# EAGLE design funkuhr (EAGLE 6.5.0)
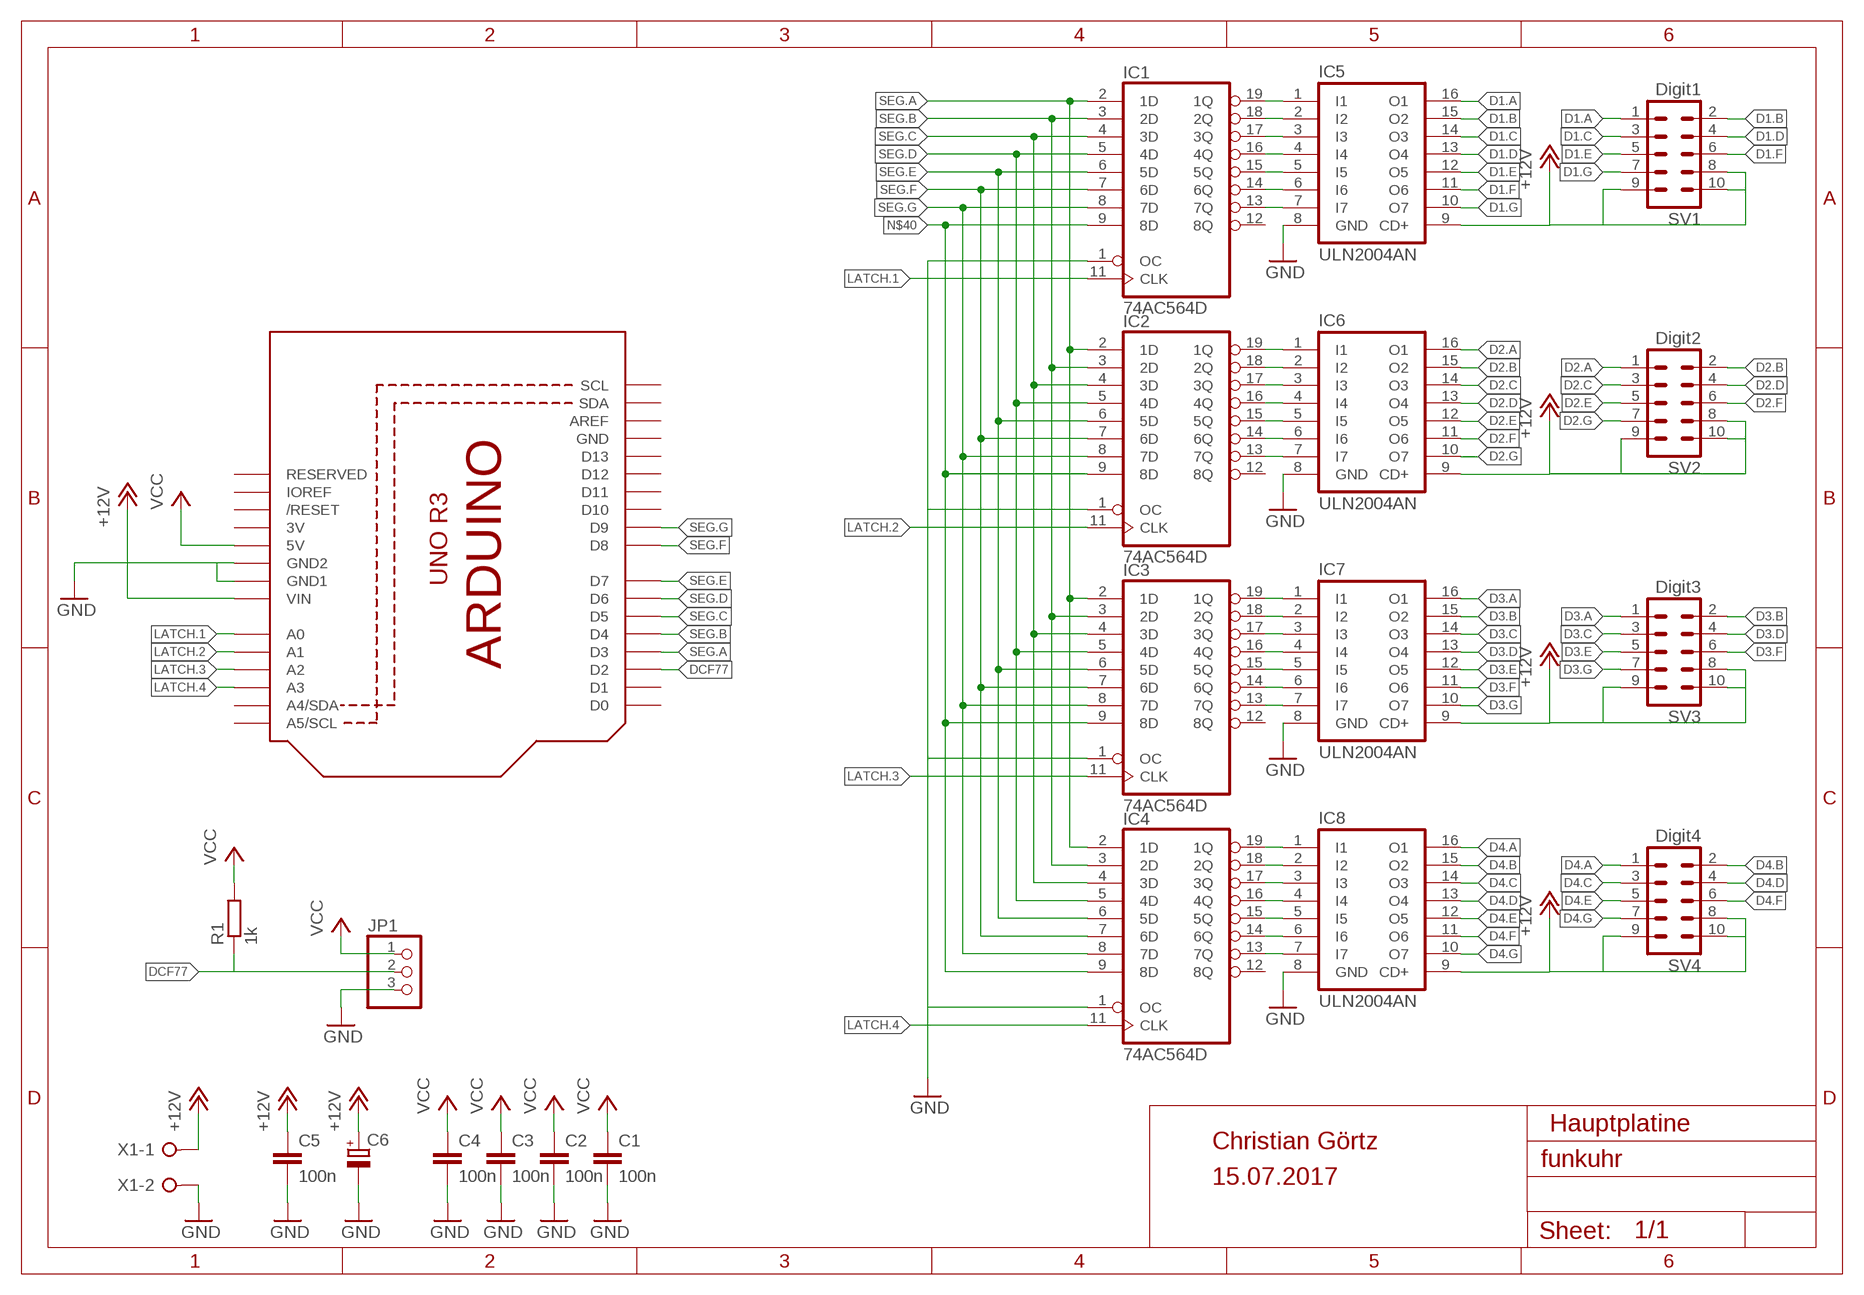
[diagram p0: schematic, sheet 1]

## Parts
C1  100n  C-EUC0805  [C0805]
C2  100n  C-EUC0805  [C0805]
C3  100n  C-EUC0805  [C0805]
C4  100n  C-EUC0805  [C0805]
C5  100n  C-EU050-024X044  [C050-024X044]
C6  CPOL-EUE2.5-6  [E2,5-6]
IC1  74AC564D  [SO20W]
IC2  74AC564D  [SO20W]
IC3  74AC564D  [SO20W]
IC4  74AC564D  [SO20W]
IC5  ULN2004AN  [DIL16]
IC6  ULN2004AN  [DIL16]
IC7  ULN2004AN  [DIL16]
IC8  ULN2004AN  [DIL16]
JP1  PINHD-1X3  [1X03]
R1  1k  R-EU_0207/10  [0207/10]
SV1  Digit1  ML10  [ML10]
SV2  Digit2  ML10  [ML10]
SV3  Digit3  ML10  [ML10]
SV4  Digit4  ML10  [ML10]
U1  ARDUINOR3-DIMENSION  [ARDUINOR3]
X1  W237-02P  [W237-132]

## Nets
+12V: C5.1 C6.+ IC5.9(CD+) IC6.9(CD+) IC7.9(CD+) IC8.9(CD+) SV1.8 SV1.9 SV1.10 SV2.8 SV2.9 SV2.10 SV3.8 SV3.9 SV3.10 SV4.8 SV4.9 SV4.10 U1.VIN X1.1
D1.A: IC5.16(O1) SV1.1
D1.B: IC5.15(O2) SV1.2
D1.C: IC5.14(O3) SV1.3
D1.D: IC5.13(O4) SV1.4
D1.E: IC5.12(O5) SV1.5
D1.F: IC5.11(O6) SV1.6
D1.G: IC5.10(O7) SV1.7
D2.A: IC6.16(O1) SV2.1
D2.B: IC6.15(O2) SV2.2
D2.C: IC6.14(O3) SV2.3
D2.D: IC6.13(O4) SV2.4
D2.E: IC6.12(O5) SV2.5
D2.F: IC6.11(O6) SV2.6
D2.G: IC6.10(O7) SV2.7
D3.A: IC7.16(O1) SV3.1
D3.B: IC7.15(O2) SV3.2
D3.C: IC7.14(O3) SV3.3
D3.D: IC7.13(O4) SV3.4
D3.E: IC7.12(O5) SV3.5
D3.F: IC7.11(O6) SV3.6
D3.G: IC7.10(O7) SV3.7
D4.A: IC8.16(O1) SV4.1
D4.B: IC8.15(O2) SV4.2
D4.C: IC8.14(O3) SV4.3
D4.D: IC8.13(O4) SV4.4
D4.E: IC8.12(O5) SV4.5
D4.F: IC8.11(O6) SV4.6
D4.G: IC8.10(O7) SV4.7
DCF77: JP1.2 R1.1 U1.D2
GND: C1.2 C2.2 C3.2 C4.2 C5.2 C6.- IC1.1(OC) IC2.1(OC) IC3.1(OC) IC4.1(OC) IC5.8(GND) IC6.8(GND) IC7.8(GND) IC8.8(GND) JP1.3 U1.GND1 U1.GND2 X1.2
LATCH.1: IC1.11(CLK) U1.A0
LATCH.2: IC2.11(CLK) U1.A1
LATCH.3: IC3.11(CLK) U1.A2
LATCH.4: IC4.11(CLK) U1.A3
N$1: IC1.19(1Q) IC5.1(I1)
N$2: IC1.18(2Q) IC5.2(I2)
N$3: IC1.17(3Q) IC5.3(I3)
N$4: IC1.16(4Q) IC5.4(I4)
N$5: IC1.15(5Q) IC5.5(I5)
N$6: IC1.14(6Q) IC5.6(I6)
N$7: IC1.13(7Q) IC5.7(I7)
N$9: IC2.19(1Q) IC6.1(I1)
N$10: IC2.18(2Q) IC6.2(I2)
N$11: IC2.17(3Q) IC6.3(I3)
N$12: IC2.16(4Q) IC6.4(I4)
N$13: IC2.15(5Q) IC6.5(I5)
N$14: IC2.14(6Q) IC6.6(I6)
N$15: IC2.13(7Q) IC6.7(I7)
N$17: IC3.19(1Q) IC7.1(I1)
N$18: IC3.18(2Q) IC7.2(I2)
N$19: IC3.17(3Q) IC7.3(I3)
N$20: IC3.16(4Q) IC7.4(I4)
N$21: IC3.15(5Q) IC7.5(I5)
N$22: IC3.14(6Q) IC7.6(I6)
N$23: IC3.13(7Q) IC7.7(I7)
N$25: IC4.19(1Q) IC8.1(I1)
N$26: IC4.18(2Q) IC8.2(I2)
N$27: IC4.17(3Q) IC8.3(I3)
N$28: IC4.16(4Q) IC8.4(I4)
N$29: IC4.15(5Q) IC8.5(I5)
N$30: IC4.14(6Q) IC8.6(I6)
N$31: IC4.13(7Q) IC8.7(I7)
N$40: IC1.9(8D) IC2.9(8D) IC3.9(8D) IC4.9(8D)
SEG.A: IC1.2(1D) IC2.2(1D) IC3.2(1D) IC4.2(1D) U1.D3
SEG.B: IC1.3(2D) IC2.3(2D) IC3.3(2D) IC4.3(2D) U1.D4
SEG.C: IC1.4(3D) IC2.4(3D) IC3.4(3D) IC4.4(3D) U1.D5
SEG.D: IC1.5(4D) IC2.5(4D) IC3.5(4D) IC4.5(4D) U1.D6
SEG.E: IC1.6(5D) IC2.6(5D) IC3.6(5D) IC4.6(5D) U1.D7
SEG.F: IC1.7(6D) IC2.7(6D) IC3.7(6D) IC4.7(6D) U1.D8
SEG.G: IC1.8(7D) IC2.8(7D) IC3.8(7D) IC4.8(7D) U1.D9
VCC: C1.1 C2.1 C3.1 C4.1 JP1.1 R1.2 U1.5V
Unconnected: IC1.12(8Q) IC2.12(8Q) IC3.12(8Q) IC4.12(8Q) U1.A4(A4/SDA) U1.A5(A5/SCL) U1.AREF U1.D0 U1.D1 U1.D10 U1.D11 U1.D12 U1.D13 U1.IOREF U1.RESERVED U1.RESET(/RESET) U1.SCL U1.SDA

## Notes on the sheet
- Hauptplatine
- Christian Görtz
- 15.07.2017

## Power pins joined to a net without a drawn wire
3V: U1.3V
GND: IC1.10(GND) IC2.10(GND) IC3.10(GND) IC4.10(GND) U1.GND
VCC: IC1.20(VCC) IC2.20(VCC) IC3.20(VCC) IC4.20(VCC)

## Library data of the parts
C1-C5 = resistor:C-EU: CAPACITOR, European symbol
C6 = resistor:CPOL-EU: POLARIZED CAPACITOR, European symbol
IC1-IC4 = 74xx-eu:74*564: Inverting 8-bit D type FLIP FLOP
IC5-IC8 = uln-udn:ULN2004A: DRIVER ARRAY
JP1 = pinhead:PINHD-1X3: PIN HEADER
R1 = resistor:R-EU_: RESISTOR, European symbol
SV1-SV4 = con-harting-ml:ML10: HARTING; OC_FARNELL: unknown; OC_NEWARK: unknown
U1 = adafruit:ARDUINOR3: This is a new object for the new Arduino R3 - with extra pins that you may want to use (such as IOref, and duplicated A4/A5
X1 = con-wago-508:W237-02P: WAGO SREW CLAMP; OC_FARNELL: unknown; OC_NEWARK: unknown

## Board
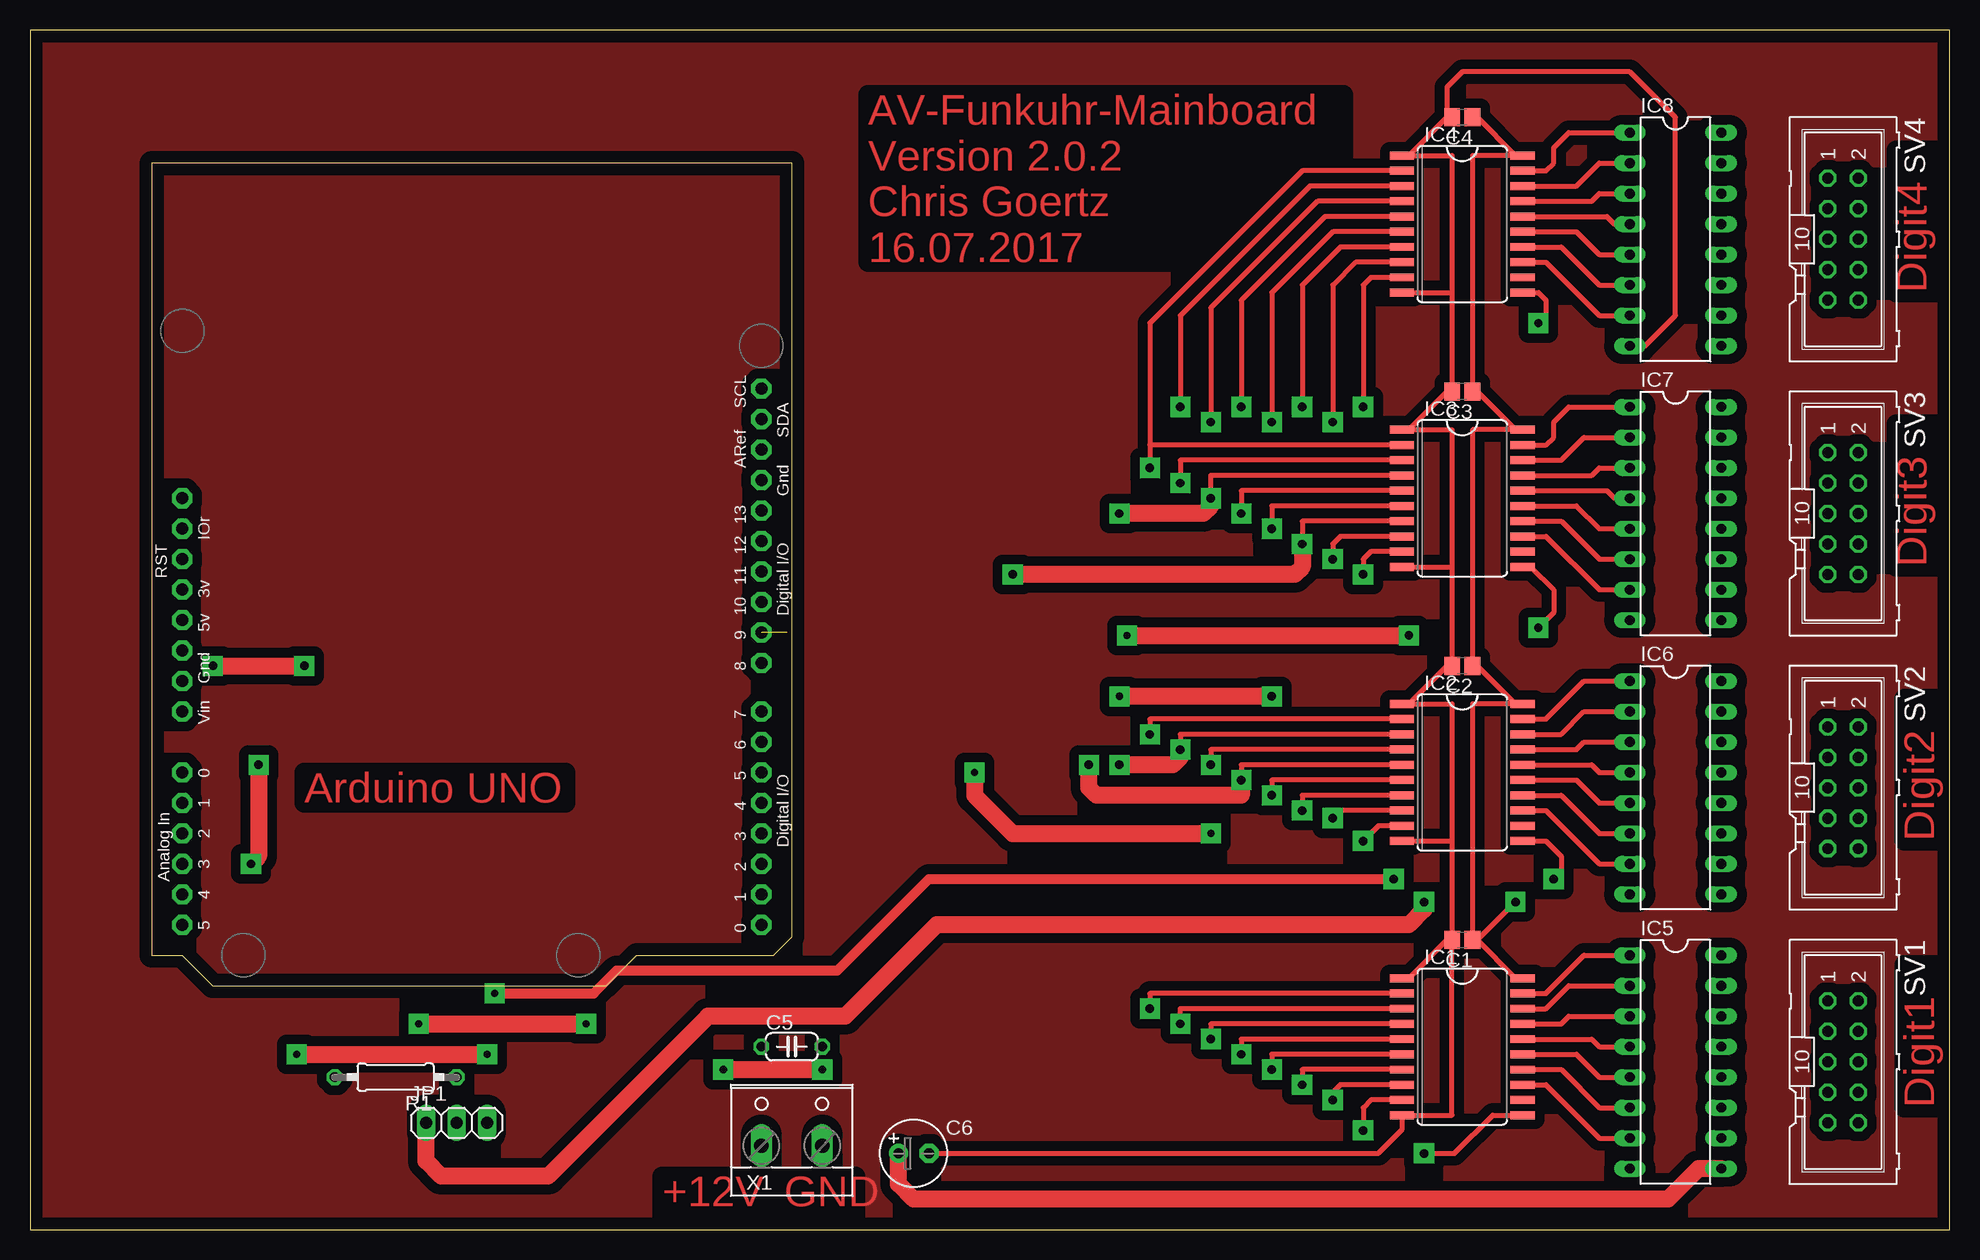
[diagram p1: board, top side]
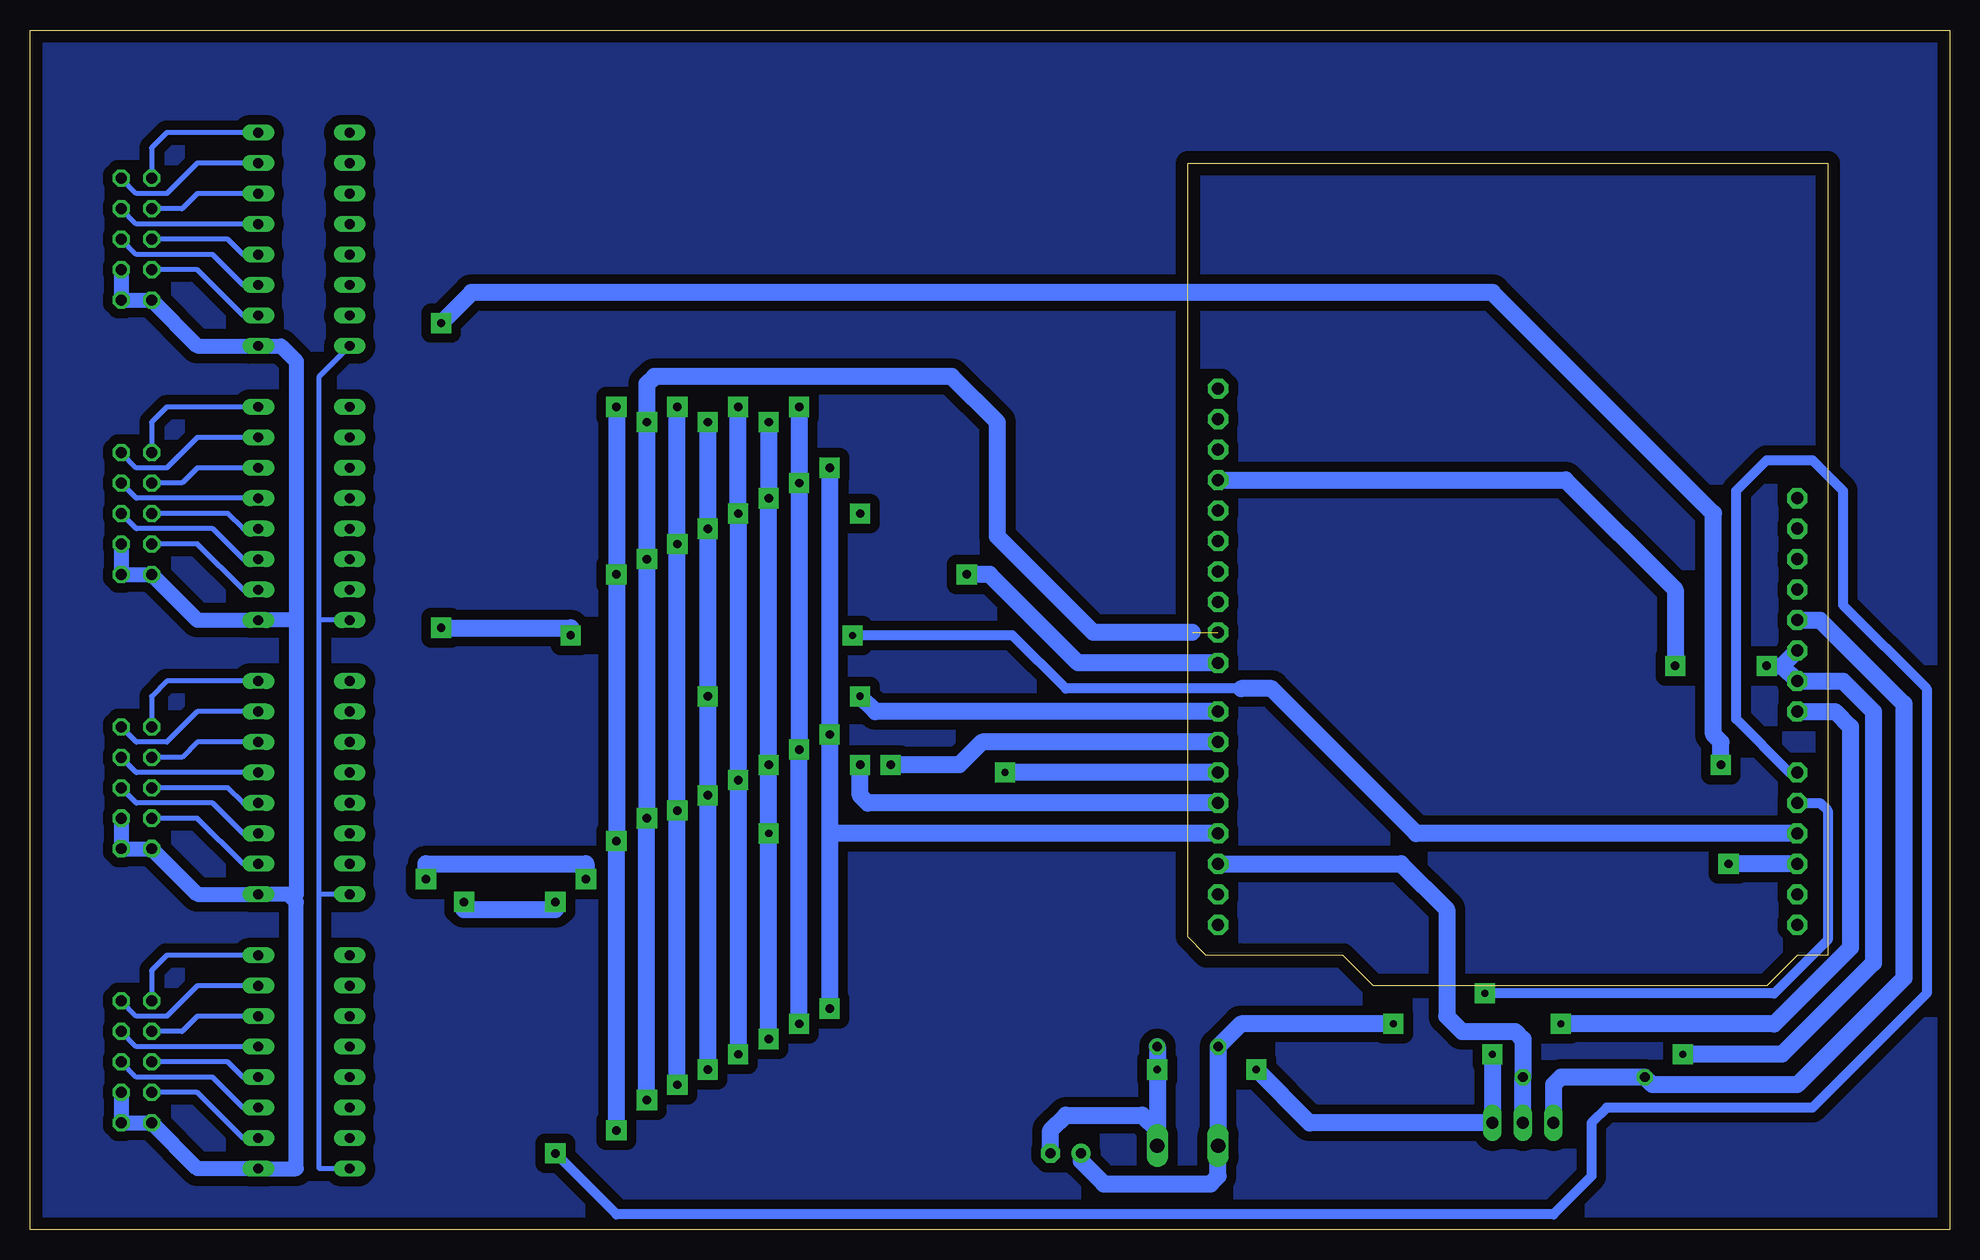
[diagram p2: board, bottom side, seen from below]

Size 160 x 100 mm. Coordinates in mm from the lower left corner, seen from the top.
Outline: 0,0 160,0 160,100 0,100 0,0
Copper layers (1*16): Top 0.035mm / dielectric 1.5mm / Bottom 0.035mm
Design rules "default": minimum track width 10mil, minimum drill 24mil, track to track 8mil, track to pad 8mil, pad to pad 8mil, via to via 8mil, smd to smd 8mil, copper to edge 40mil, drill to drill 8mil, minimum pad ring 10mil, minimum via ring 8mil, stop-mask expansion 4mil, vias tented up to drill 0mil, thermal gap 10mil

### Footprints (pad centres in the part's own frame; a part is rotated, then mirrored left to right if it is on the bottom)
C0805 = smd 1.3 x 1.5: 1 -0.85,0; 2 0.85,0
C050-024X044 = drill 0.813 octagon: 1 -2.54,0; 2 2.54,0
E2,5-6 = drill 0.813 pad 1.6: + -1.27,0 | drill 0.813 pad 1.6 octagon: - 1.27,0
SO20W = smd 0.66 x 2.032: 1 -5.715,-5.029; 2 -4.445,-5.029; 3 -3.175,-5.029; 4 -1.905,-5.029; 5 -0.635,-5.029; 6 0.635,-5.029; 7 1.905,-5.029; 8 3.175,-5.029; 9 4.445,-5.029; 10 5.715,-5.029; 11 5.715,5.029; 12 4.445,5.029; 13 3.175,5.029; 14 1.905,5.029; 15 0.635,5.029; 16 -0.635,5.029; 17 -1.905,5.029; 18 -3.175,5.029; 19 -4.445,5.029; 20 -5.715,5.029
DIL16 = drill 0.813 long: 1 -8.89,-3.81; 2 -6.35,-3.81; 3 -3.81,-3.81; 4 -1.27,-3.81; 5 1.27,-3.81; 6 3.81,-3.81; 7 6.35,-3.81; 8 8.89,-3.81; 9 8.89,3.81; 10 6.35,3.81; 11 3.81,3.81; 12 1.27,3.81; 13 -1.27,3.81; 14 -3.81,3.81; 15 -6.35,3.81; 16 -8.89,3.81
1X03 = drill 1.016 long: 1 -2.54,0; 2 0,0; 3 2.54,0
0207/10 = drill 0.813 octagon: 1 -5.08,0; 2 5.08,0
ML10 = drill 0.914 octagon: 1 -5.08,-1.27; 2 -5.08,1.27; 3 -2.54,-1.27; 4 -2.54,1.27; 5 0,-1.27; 6 0,1.27; 7 2.54,-1.27; 8 2.54,1.27; 9 5.08,-1.27; 10 5.08,1.27
ARDUINOR3 = drill 1 pad 1.676 octagon: 3V 35.56,2.54; 5V 38.1,2.54; A0 50.8,2.54; A1 53.34,2.54; A2 55.88,2.54; A3 58.42,2.54; A4 60.96,2.54; A5 63.5,2.54; AREF 23.876,50.8; D0 63.5,50.8; D1 60.96,50.8; D2 58.42,50.8; D3 55.88,50.8; D4 53.34,50.8; D5 50.8,50.8; D6 48.26,50.8; D7 45.72,50.8; D8 41.656,50.8; D9 39.116,50.8; D10 36.576,50.8; D11 34.036,50.8; D12 31.496,50.8; D13 28.956,50.8; GND 26.416,50.8; GND1 43.18,2.54; GND2 40.64,2.54; IOREF 30.48,2.54; RESERVED 27.94,2.54; RESET 33.02,2.54; SCL 18.796,50.8; SDA 21.336,50.8; VIN 45.72,2.54
W237-132 = drill 1.194 long: 1 -2.54,-0.635; 2 2.54,-0.635

### Placement (x,y rotation side)
C1  119.38,24.13 180 top
C2  119.38,46.99 180 top
C3  119.38,69.85 180 top
C4  119.38,92.71 180 top
C5  63.5,15.24 0 top
C6  73.66,6.35 0 top
IC1  119.38,15.24 270 top
IC2  119.38,38.1 270 top
IC3  119.38,60.96 270 top
IC4  119.38,83.82 270 top
IC5  137.16,13.97 270 top
IC6  137.16,36.83 270 top
IC7  137.16,59.69 270 top
IC8  137.16,82.55 270 top
JP1  35.56,8.89 0 top
R1  30.48,12.7 180 top
SV1  151.13,13.97 270 top
SV2  151.13,36.83 270 top
SV3  151.13,59.69 270 top
SV4  151.13,82.55 270 top
U1  10.16,88.9 270 top
X1  63.5,7.62 0 top

### Tracks (layer width: path | path; a pad name or v marks a point on that pad's centre or on a via)
+12V  (via drill 0.6 pad 1.68)
  Top 1.422: IC5.9 139.06,5.08 136.53,2.54 73.66,2.54 72.39,3.81 C6.+ | v32.38,17.14 v46.35,17.14
  Bottom 0.406: IC8.9 142.24,73.66 | IC5.9 138.43,5.08
  Bottom 1.27: 137.79,50.8 137.79,72.39 139.06,73.66 IC8.9 146.05,73.66 SV4.9 SV4.10 SV4.8 | 137.79,50.8 IC7.9 146.05,50.8 SV3.9 SV3.10 SV3.8 | 137.79,50.8 137.79,27.94 138.43,27.94 | 138.43,27.94 IC6.9 146.05,27.94 SV2.9 SV2.10 SV2.8 | 138.43,27.94 137.79,27.3 137.79,5.08 IC5.9 146.05,5.08 SV1.9 SV1.10 SV1.8
  Bottom 1.422: C6.+ 72.39,5.71 70.48,3.81 61.59,3.81 60.96,4.45 X1.1 C5.1 59.05,17.14 v46.35,17.14 | U1.VIN 9.53,43.18 8.26,41.91 8.26,23.5 14.61,17.14 v32.38,17.14
D1.A
  Bottom 0.406: IC5.16 148.59,22.86 149.86,21.59 SV1.1
D1.B
  Bottom 0.406: IC5.15 146.05,20.32 148.59,17.78 151.13,17.78 SV1.2
D1.C
  Bottom 0.406: IC5.14 146.05,17.78 147.32,16.51 SV1.3
D1.D
  Bottom 0.406: IC5.13 151.13,15.24 SV1.4
D1.E
  Bottom 0.406: IC5.12 142.24,12.7 143.51,13.97 SV1.5
D1.F
  Bottom 0.406: IC5.11 142.24,10.16 144.78,12.7 151.13,12.7 SV1.6
D1.G
  Bottom 0.406: IC5.10 142.24,7.62 146.05,11.43 SV1.7
D2.A
  Bottom 0.406: IC6.16 148.59,45.72 149.86,44.45 SV2.1
D2.B
  Bottom 0.406: IC6.15 146.05,43.18 148.59,40.64 151.13,40.64 SV2.2
D2.C
  Bottom 0.406: IC6.14 146.05,40.64 147.32,39.37 SV2.3
D2.D
  Bottom 0.406: IC6.13 151.13,38.1 SV2.4
D2.E
  Bottom 0.406: IC6.12 142.24,35.56 143.51,36.83 SV2.5
D2.F
  Bottom 0.406: IC6.11 142.24,33.02 144.78,35.56 151.13,35.56 SV2.6
D2.G
  Bottom 0.406: IC6.10 142.24,30.48 146.05,34.29 SV2.7
D3.A
  Bottom 0.406: IC7.16 148.59,68.58 149.86,67.31 SV3.1
D3.B
  Bottom 0.406: IC7.15 146.05,66.04 148.59,63.5 151.13,63.5 SV3.2
D3.C
  Bottom 0.406: IC7.14 146.05,63.5 147.32,62.23 SV3.3
D3.D
  Bottom 0.406: IC7.13 151.13,60.96 SV3.4
D3.E
  Bottom 0.406: IC7.12 142.24,58.42 143.51,59.69 SV3.5
D3.F
  Bottom 0.406: IC7.11 142.24,55.88 144.78,58.42 151.13,58.42 SV3.6
D3.G
  Bottom 0.406: IC7.10 142.24,53.34 146.05,57.15 SV3.7
D4.A
  Bottom 0.406: IC8.16 148.59,91.44 149.86,90.17 SV4.1
D4.B
  Bottom 0.406: IC8.15 146.05,88.9 148.59,86.36 151.13,86.36 SV4.2
D4.C
  Bottom 0.406: IC8.14 146.05,86.36 147.32,85.09 SV4.3
D4.D
  Bottom 0.406: IC8.13 151.13,83.82 SV4.4
D4.E
  Bottom 0.406: IC8.12 142.24,81.28 143.51,82.55 SV4.5
D4.F
  Bottom 0.406: IC8.11 142.24,78.74 144.78,81.28 151.13,81.28 SV4.6
D4.G
  Bottom 0.406: IC8.10 142.24,76.2 146.05,80.01 SV4.7
DCF77
  Bottom 1.422: JP1.2 R1.1 35.56,15.88 36.2,16.51 40.64,16.51 41.91,17.78 41.91,26.67 45.72,30.48 U1.D2
GND  (via drill 0.6 pad 1.68, 0.7 pad 1.68)
  Top 0.406: IC1.1 114.94,20.95 118.11,24.13 C1.2 | 118.53,78.11 118.53,89.53 IC4.1 114.94,89.53 118.11,92.71 C4.2 118.11,93.13 118.11,95.25 119.38,96.52 133.35,96.52 137.16,92.71 137.16,76.2 134.62,73.66 IC8.8 | 118.53,78.11 C3.2 118.11,69.85 114.94,66.67 IC3.1 118.53,66.67 118.53,55.24 | IC4.10 118.53,78.11 | 118.53,55.24 C2.2 118.11,46.99 114.94,43.81 IC2.1 118.53,43.81 118.53,32.38 | IC3.10 118.53,55.24 | IC2.10 118.53,32.38 | 118.53,32.38 C1.2 | C1.2 118.53,9.53 IC1.10 114.35,8.31 112.39,6.35 C6.-
  Top 1.422: v22.23,14.61 v38.1,14.61 | v57.78,13.34 v66.04,13.34 | v15.24,46.99 v22.86,46.99
  Bottom 0.406: 135.89,27.94 135.89,5.08 IC5.8 | 135.89,27.94 135.89,50.8 | 135.89,50.8 135.89,71.12 IC8.8 | IC7.8 135.89,50.8 | IC6.8 135.89,27.94
  Bottom 1.422: C6.- 74.93,8.26 73.66,9.53 67.31,9.53 66.04,8.26 X1.2 v66.04,13.34 C5.2 | v15.24,46.99 13.97,46.99 | 13.97,46.99 U1.GND1 8.89,45.72 6.35,43.18 6.35,22.23 13.97,14.61 v22.23,14.61 | U1.GND2 13.97,46.99 | v38.1,14.61 JP1.3 53.34,8.89 v57.78,13.34 | U1.GND 32,62.48 22.86,53.34 v22.86,46.99
LATCH.1  (via drill 0.7 pad 1.68)
  Top 0.406: v116.2,6.35 118.75,6.35 121.92,9.53 IC1.11
  Bottom 0.406: 34.29,1.27 111.12,1.27
  Bottom 0.813: U1.A0 13.34,38.1 17.78,42.55 17.78,61.59 15.24,64.14 11.43,64.14 8.89,61.59 8.89,52.07 1.91,45.09 1.91,19.68 11.43,10.16 28.57,10.16 29.84,8.89 29.84,4.45 33.02,1.27 111.12,1.27 v116.2,6.35
LATCH.2  (via drill 0.6 pad 1.68, 0.7 pad 1.68)
  Top 0.406: IC2.11 126.36,32.38 127.64,31.11 127.64,29.84 v127,29.21
  Top 0.813: v38.73,19.68 46.99,19.68 48.9,21.59 67.31,21.59 74.93,29.21 v113.67,29.21
  Bottom 0.813: U1.A1 10.79,35.56 10.16,34.92 10.16,24.13 14.61,19.68 v38.73,19.68
  Bottom 1.422: v127,29.21 127,30.48 113.67,30.48 v113.67,29.21
LATCH.3  (via drill 0.6 pad 1.68, 0.7 pad 1.68)
  Top 0.406: IC3.11 125.09,55.24 127,53.34 127,51.44 v125.73,50.16
  Top 1.422: v91.44,49.53 v114.94,49.53
  Bottom 0.406: 115.57,50.16 v114.94,49.53
  Bottom 0.813: 59.05,45.09 73.66,45.09 78.11,49.53 v91.44,49.53
  Bottom 1.422: v125.73,50.16 114.94,50.16 v114.94,49.53 | U1.A2 44.45,33.02 56.52,45.09 59.05,45.09
LATCH.4  (via drill 0.7 pad 1.68)
  Top 0.406: IC4.11 125.73,78.11 126.36,77.47 126.36,76.2 v125.73,75.56
  Top 1.422: v19.05,38.73 19.05,31.11 v18.41,30.48
  Bottom 1.422: U1.A3 v18.41,30.48 | v19.05,38.73 19.05,40.64 19.68,41.27 19.68,59.69 38.1,78.11 123.19,78.11 v125.73,75.56
N$1
  Top 0.406: IC1.19 126.36,19.68 129.54,22.86 IC5.1
N$2
  Top 0.406: IC1.18 126.36,18.41 128.27,20.32 IC5.2
N$3
  Top 0.406: IC1.17 127.64,17.14 128.27,17.78 IC5.3
N$4
  Top 0.406: IC1.16 130.18,15.88 130.81,15.24 IC5.4
N$5
  Top 0.406: IC1.15 128.91,14.61 130.81,12.7 IC5.5
N$6
  Top 0.406: IC1.14 127.64,13.34 130.81,10.16 IC5.6
N$7
  Top 0.406: IC1.13 126.36,12.06 130.81,7.62 IC5.7
N$8
  pour Top (isolate 0.813): 0,99.69 160.02,99.69 160.02,0 0,0
N$9
  Top 0.406: IC2.19 126.36,42.55 129.54,45.72 IC6.1
N$10
  Top 0.406: IC2.18 127.64,41.27 129.54,43.18 IC6.2
N$11
  Top 0.406: IC2.17 128.91,40.01 129.54,40.64 IC6.3
N$12
  Top 0.406: IC2.16 130.18,38.73 130.81,38.1 IC6.4
N$13
  Top 0.406: IC2.15 128.91,37.47 130.81,35.56 IC6.5
N$14
  Top 0.406: IC2.14 127.64,36.2 130.81,33.02 IC6.6
N$15
  Top 0.406: IC2.13 126.36,34.92 130.81,30.48 IC6.7
N$16
  pour Bottom (isolate 0.813): 0,99.69 160.02,99.69 160.02,0 0,0
N$17
  Top 0.406: IC3.19 126.36,65.41 127,66.04 127,67.31 128.27,68.58 IC7.1
N$18
  Top 0.406: IC3.18 127.64,64.14 129.54,66.04 IC7.2
N$19
  Top 0.406: IC3.17 130.18,62.87 130.81,63.5 IC7.3
N$20
  Top 0.406: IC3.16 131.44,61.59 132.08,60.96 IC7.4
N$21
  Top 0.406: IC3.15 128.91,60.33 130.81,58.42 IC7.5
N$22
  Top 0.406: IC3.14 127.64,59.05 130.81,55.88 IC7.6
N$23
  Top 0.406: IC3.13 126.36,57.78 130.81,53.34 IC7.7
N$25
  Top 0.406: IC4.19 126.36,88.27 127,88.9 127,90.17 128.27,91.44 IC8.1
N$26
  Top 0.406: IC4.18 128.91,87 130.81,88.9 IC8.2
N$27
  Top 0.406: IC4.17 130.18,85.72 130.81,86.36 IC8.3
N$28
  Top 0.406: IC4.16 131.44,84.45 132.08,83.82 IC8.4
N$29
  Top 0.406: IC4.15 128.91,83.19 130.81,81.28 IC8.5
N$30
  Top 0.406: IC4.14 127.64,81.92 130.81,78.74 IC8.6
N$31
  Top 0.406: IC4.13 126.36,80.64 130.81,76.2 IC8.7
N$40  (via drill 0.7 pad 1.68)
  Top 0.406: IC3.9 111.76,56.52 111.12,55.88 v111.12,54.61 | IC4.9 111.76,79.38 111.12,78.74 v111.12,68.58 | IC2.9 112.39,33.66 v111.12,32.38 | IC1.9 111.76,10.79 111.12,10.16 v111.12,8.26
  Bottom 1.422: v111.12,68.58 v111.12,54.61 v111.12,32.38 v111.12,8.26
SEG.A  (via drill 0.7 pad 1.68)
  Top 0.406: IC4.2 106.05,88.27 93.34,75.56 93.34,65.41 | IC1.2 93.34,19.68 v93.34,18.41 | IC2.2 93.34,42.55 v93.34,41.27 | IC3.2 93.34,65.41 | 93.34,65.41 v93.34,63.5
  Bottom 1.422: 93.34,33.02 v93.34,41.27 v93.34,63.5 | 93.34,33.02 v93.34,18.41 | U1.D3 93.34,33.02
SEG.B  (via drill 0.7 pad 1.68)
  Top 0.406: IC2.3 95.89,41.27 v95.89,40.01 | IC4.3 106.68,87 95.89,76.2 v95.89,68.58 | IC1.3 95.89,18.41 v95.89,17.14 | IC3.3 95.89,64.14 v95.89,62.23
  Top 1.422: v95.89,40.01 95.89,39.37 95.25,38.73 v90.81,38.73
  Bottom 1.422: v95.89,17.14 v95.89,40.01 v95.89,62.23 v95.89,68.58 | U1.D4 90.17,35.56 90.81,36.2 v90.81,38.73
SEG.C  (via drill 0.6 pad 1.68, 0.7 pad 1.68)
  Top 0.406: IC4.4 107.31,85.72 98.42,76.83 v98.42,67.31 | IC1.4 98.42,17.14 v98.42,15.88 | IC2.4 98.42,40.01 v98.42,38.73 | IC3.4 98.42,62.87 v98.42,60.96
  Top 1.422: v98.42,60.96 98.42,60.33 97.79,59.69 v90.81,59.69 | v78.74,38.1 78.74,36.2 81.92,33.02 v98.42,33.02
  Bottom 1.422: v98.42,15.88 v98.42,33.02 v98.42,38.73 v98.42,60.96 v98.42,67.31 | U1.D5 v78.74,38.1
SEG.D  (via drill 0.7 pad 1.68)
  Top 0.406: IC4.5 107.95,84.45 100.97,77.47 v100.97,68.58 | IC1.5 100.97,15.88 v100.97,14.61 | IC2.5 100.97,38.73 v100.97,37.47 | IC3.5 100.97,61.59 v100.97,59.69
  Top 1.422: v100.97,37.47 100.97,36.2 88.9,36.2 88.27,36.83 v88.27,38.73
  Bottom 1.422: v100.97,14.61 v100.97,37.47 v100.97,59.69 v100.97,68.58 | U1.D6 80.64,40.64 82.55,38.73 v88.27,38.73
SEG.E  (via drill 0.6 pad 1.68, 0.7 pad 1.68)
  Top 0.406: IC4.6 108.58,83.19 103.5,78.11 v103.5,67.31 | IC1.6 103.5,14.61 v103.5,13.34 | IC2.6 103.5,37.47 v103.5,36.2 | IC3.6 103.5,60.33 v103.5,58.42
  Top 1.422: v103.5,44.45 v90.81,44.45
  Bottom 1.422: v103.5,13.34 v103.5,36.2 v103.5,44.45 v103.5,58.42 v103.5,67.31 | U1.D7 89.53,43.18 v90.81,44.45
SEG.F  (via drill 0.7 pad 1.68)
  Top 0.406: IC4.7 109.22,81.92 106.05,78.74 v106.05,68.58 | IC2.7 106.05,36.2 v106.05,34.92 | IC1.7 106.05,13.34 v106.05,12.06 | IC3.7 106.05,59.05 v106.05,57.15
  Top 1.422: v106.05,57.15 106.05,55.24 105.41,54.61 v81.92,54.61
  Bottom 1.422: v106.05,68.58 v106.05,57.15 v106.05,34.92 v106.05,12.06 | U1.D8 72.64,47.24 80.01,54.61 v81.92,54.61
SEG.G  (via drill 0.7 pad 1.68)  (1 unrouted)
  Top 0.406: IC4.8 110.49,80.64 108.58,78.74 v108.58,67.31 | IC3.8 109.22,57.78 108.58,57.15 v108.58,55.88 | IC2.8 109.22,34.92 v108.58,34.29 | IC1.8 109.22,12.06 108.58,11.43 v108.58,10.79
  Bottom 1.422: v108.58,10.79 v108.58,34.29 v108.58,55.88 v108.58,67.31 108.58,70.48 107.95,71.12 83.19,71.12 79.38,67.31 79.38,57.78 71.37,49.78 63.12,49.78
VCC  (via drill 0.7 pad 1.68)
  Top 0.406: C4.1 120.65,92.71 123.83,89.53 IC4.20 120.23,89.53 C3.1 120.65,69.85 123.83,66.67 IC3.20 120.23,66.67 C2.1 120.65,46.99 123.83,43.81 IC2.20 120.23,43.81 C1.1 120.65,24.13 | IC1.20 123.83,20.95 120.65,24.13 | 120.65,24.13 v123.83,27.3
  Top 1.422: v116.2,27.3 116.2,26.67 114.94,25.4 75.56,25.4 67.94,17.78 56.52,17.78 43.18,4.45 34.29,4.45 33.02,5.71 JP1.1
  Bottom 1.422: v123.83,27.3 123.83,26.67 116.2,26.67 v116.2,27.3 | JP1.1 33.02,12.06 32.38,12.7 R1.2 24.77,12.06 12.7,12.06 3.81,20.95 3.81,43.81 10.79,50.8 U1.5V

### Text on the board
Top: AV-Funkuhr-Mainboard / Version 2.0.2 / Chris Goertz / 16.07.2017 | Digit4 | Digit3 | Arduino UNO | Digit2 | Digit1 | +12V | GND